# Altium schematic sheet extensionBoard.SchDoc
size A4
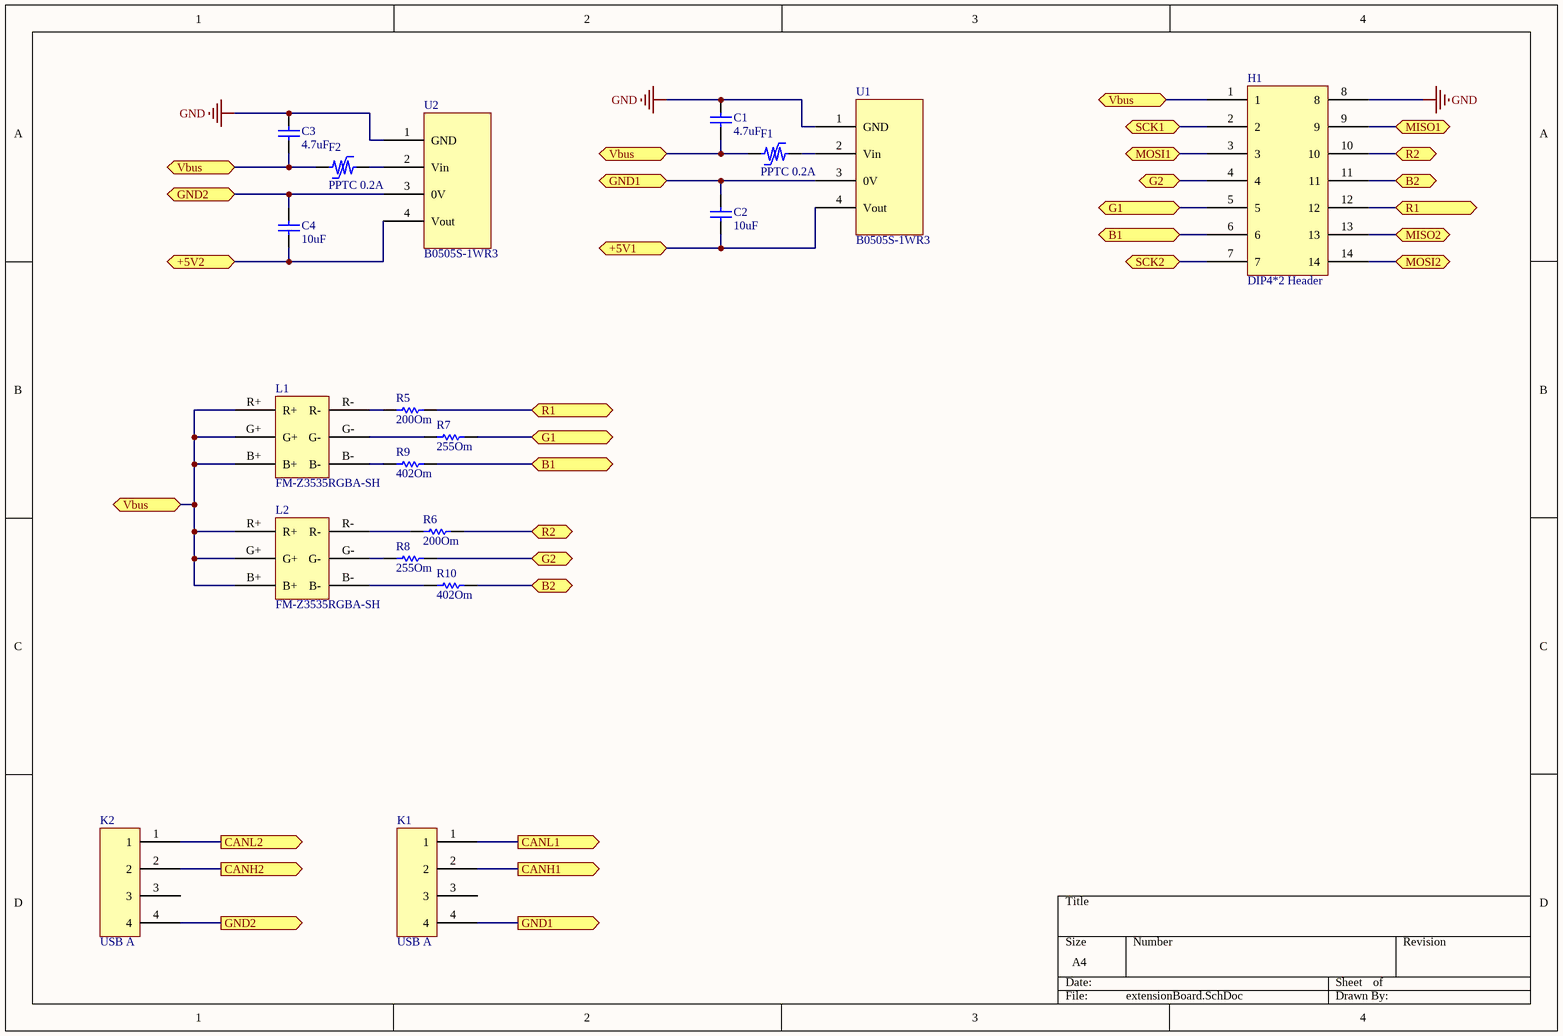
[diagram p0: extensionBoard.SchDoc]

## Parts
C1  4.7uF  [CAPC1608X90X35ML10T15]
C2  10uF  [CAPC1608X90X35ML10T15]
C3  4.7uF  [CAPC1608X90X35ML10T15]
C4  10uF  [CAPC1608X90X35ML10T15]
F1  PPTC 0.2A  [PTC 0603]
F2  PPTC 0.2A  [PTC 0603]
H1  DIP4*2 Header  [DIP7*2]
K1  USB A  [USB A]
K2  USB A  [USB A]
L1  FM-Z3535RGBA-SH  [Z3535RGBA]
L2  FM-Z3535RGBA-SH  [Z3535RGBA]
R5  200Om  [RESC1608X55X30ML20T10]
R6  200Om  [RESC1608X55X30ML20T10]
R7  255Om  [RESC1608X55X30ML20T10]
R8  255Om  [RESC1608X55X30ML20T10]
R9  402Om  [RESC1608X55X30ML20T10]
R10  402Om  [RESC1608X55X30ML20T10]
U1  B0505S-1WR3  [Dip4 package]
U2  B0505S-1WR3  [Dip4 package]

## Ports
+5V1 (bidir), +5V2 (bidir), B1 (bidir), B2 (bidir), CANH1 (out), CANH2 (out), CANL1 (out), CANL2 (out), G1 (bidir), G2 (bidir), GND1 (bidir), GND1 (out), GND2 (bidir), GND2 (out), MISO1 (bidir), MISO2 (bidir), MOSI1 (bidir), MOSI2 (bidir), R1 (bidir), R2 (bidir), SCK1 (bidir), SCK2 (bidir), Vbus (bidir)

## Nets
GND: C1.2 C3.2 H1.8 U1.1(GND) U2.1(GND)
+5V1: C2.1 U1.4(Vout) ; port +5V1
+5V2: C4.1 U2.4(Vout) ; port +5V2
B1: H1.6 R9.2 ; port B1
B2: H1.11 R10.2 ; port B2
CANH1: K1.2 ; port CANH1
CANH2: K2.2 ; port CANH2
CANL1: K1.1 ; port CANL1
CANL2: K2.1 ; port CANL2
G1: H1.5 R7.2 ; port G1
G2: H1.4 R8.2 ; port G2
GND1: C2.2 K1.4 U1.3(0V) ; port GND1
GND2: C4.2 K2.4 U2.3(0V) ; port GND2
MISO1: H1.9 ; port MISO1
MISO2: H1.13 ; port MISO2
MOSI1: H1.3 ; port MOSI1
MOSI2: H1.14 ; port MOSI2
R1: H1.12 R5.2 ; port R1
R2: H1.10 R6.2 ; port R2
SCK1: H1.2 ; port SCK1
SCK2: H1.7 ; port SCK2
Vbus: C1.1 C3.1 F1.1 F2.1 H1.1 L1.B+ L1.G+ L1.R+ L2.B+ L2.G+ L2.R+ ; port Vbus
NetF1_2: F1.2 U1.2(Vin)
NetF2_2: F2.2 U2.2(Vin)
NetL1_B-: L1.B- R9.1
NetL1_G-: L1.G- R7.1
NetL1_R-: L1.R- R5.1
NetL2_B-: L2.B- R10.1
NetL2_G-: L2.G- R8.1
NetL2_R-: L2.R- R6.1

Not connected (* = marked no-connect by the designer): K1 3; K2 3

## Library data of the parts
C1-C4 = CMP-2006-02335-1: Manufacturer: Murata; Part Number: GCM1885C2A101JA16D
F1 F2 = PTC Resettable Fuse
R5-R10 = CMP-2000-01555-1: Part Number: RK73H1JTTD5101F; Manufacturer: KOA Speer
L1 L2 = FM-Z3535RGBA-SH: ComponentLink1Description: New link; ComponentLink1URL: https://lcsc.com/product-detail/Light-Emitting-Diodes-LED_SMDLED-120-480mcd_C110903.html
U1 U2 = B0505S-1WR3: ComponentLink1Description: New link; ComponentLink1URL: https://lcsc.com/product-detail/Power-Modules_B0505S-1WR3_C131038.html